# Altium schematic sheet OdomEncoders.SchDoc
size A; SheetNumber: 3; SheetTotal: 10
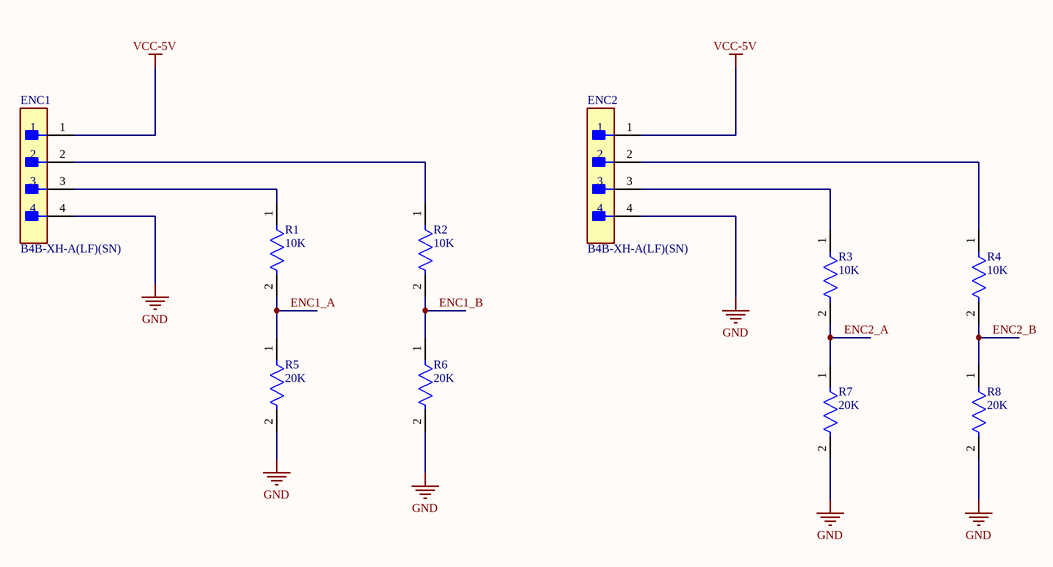
[diagram p0: OdomEncoders.SchDoc]

## Parts
ENC1  B4B-XH-A(LF)(SN)  [FP-B4B-XH-A_LF_SN-MFG]
ENC2  B4B-XH-A(LF)(SN)  [FP-B4B-XH-A_LF_SN-MFG]
R1  10K  [FP-RC0603-0_55-IPC_C]
R2  10K  [FP-RC0603-0_55-IPC_C]
R3  10K  [FP-RC0603-0_55-IPC_C]
R4  10K  [FP-RC0603-0_55-IPC_C]
R5  20K  [FP-RC0603-0_55-IPC_C]
R6  20K  [FP-RC0603-0_55-IPC_C]
R7  20K  [FP-RC0603-0_55-IPC_C]
R8  20K  [FP-RC0603-0_55-IPC_C]

## Nets
GND: ENC1.4 ENC2.4 R5.2 R6.2 R7.2 R8.2
VCC-5V: ENC1.1 ENC2.1
ENC1_A: R1.2 R5.1
ENC1_B: R2.2 R6.1
ENC2_A: R3.2 R7.1
ENC2_B: R4.2 R8.1
NetENC1_2: ENC1.2 R2.1
NetENC1_3: ENC1.3 R1.1
NetENC2_2: ENC2.2 R4.1
NetENC2_3: ENC2.3 R3.1

## Library data of the parts
ENC1 ENC2 = CMP-17439-000250-1: CONN HEADER VERT 4POS 2.5MM; Number of Contacts: 4; Contact Resistance: 20mR; Voltage Rating: 250V; Max Current Rating: 3A; Gender: Male; Wire/Cable Gauge: 22AWG; Mated Stacking Heights: 9.8mm; Insulation Resistance: 1GR; Orientation: Straight; Contact Type: Male Pin; Contact Finish - Mating: TIN; Series: XH; Max Voltage Rating (AC): 250V; Lead Pitch: 2.5mm; Contact Shape: Square; Insulation Color: Natural; Termination: Solder; Lead Free: Lead Free; Voltage Rating (AC): 250V; Number of Rows: 1; Flammability Rating: UL94 V-0; Number of Positions: 4; Max Operating Temperature: 85°C; Package Quantity: 500; Mount: Through Hole; REACH SVHC: No SVHC; Connector Type: Header; Insulation Material: Nylon; Fastening Type: Detent; Min Operating Temperature: -25°C; Housing Color: White; Packaging: Bulk; Contact Plating: Tin; Contact Material: Brass; Max Voltage Rating (DC): 250V; Housing Material: Polyamide; Color: Natural; Material: Polyamide; Pitch: 2.5mm; Depth: 5.75mm; Current Rating: 3A; Length: 12.4mm
R1-R4 = CMP-2100-03664-2: RES 10K OHM 1% 1/10W 0603; Voltage Rating: 75V; Voltage Rating (DC): 50V; Resistance: 10kR; Power Rating: 100mW; Temperature Coefficient: 100ppm/°C; Depth: 0.8mm; Termination: SMD/SMT; Resistor Type: Thick Film; Series: RC; Construction: Rectangular; Features: Moisture Resistant; Packaging: Tape and Reel; Min Operating Temperature: -55°C; Number of Terminations: 2; Lead Pitch: 0.3mm; RoHS Compliant: Yes; Case/Package: 0603; Resistance Tolerance: 1%; Military Standard: Not; Weight: 7.1E-05oz; Number of Pins: 2; Tolerance: 1%; Length: 1.6mm; Case Code (Imperial): 0603; Lead Free: Lead Free; Width: 0.8mm; Max Power Dissipation: 100mW; Height: 0.45mm; Max Operating Temperature: 155°C; Case Code (Metric): 1608; Size Code: 0603
R5-R8 = CMP-2000-06932-2: RES 20K OHM 1% 1/10W 0603; Voltage Rating: 50V; Temperature Coefficient: 100ppm/°C; Power Rating: 100mW; Resistance: 20kR; Height: 0.022inch; REACH SVHC: No SVHC; Case Code (Metric): 1608; Depth: 0.8mm; Tolerance: 1%; Min Operating Temperature: -55°C; Series: RC; RoHS Compliant: Yes; Resistor Type: Thick Film; Max Power Dissipation: 100mW; Features: Moisture Resistant; Max Operating Temperature: 155°C; Package Quantity: 1; Size Code: 0603; Packaging: Tape and Reel; Width: 0.031inch; Length: 0.063inch; Military Standard: Not; Technology: THICK FILM; Number of Terminations: 2; Termination: SMD/SMT; Construction: Rectangular; Case/Package: 0603; Number of Pins: 2; Lead Free: Lead Free; Voltage Rating (DC): 50V; Resistance Tolerance: 1%; Case Code (Imperial): 0603